# EAGLE schematic untitled (EAGLE 9.6.2)
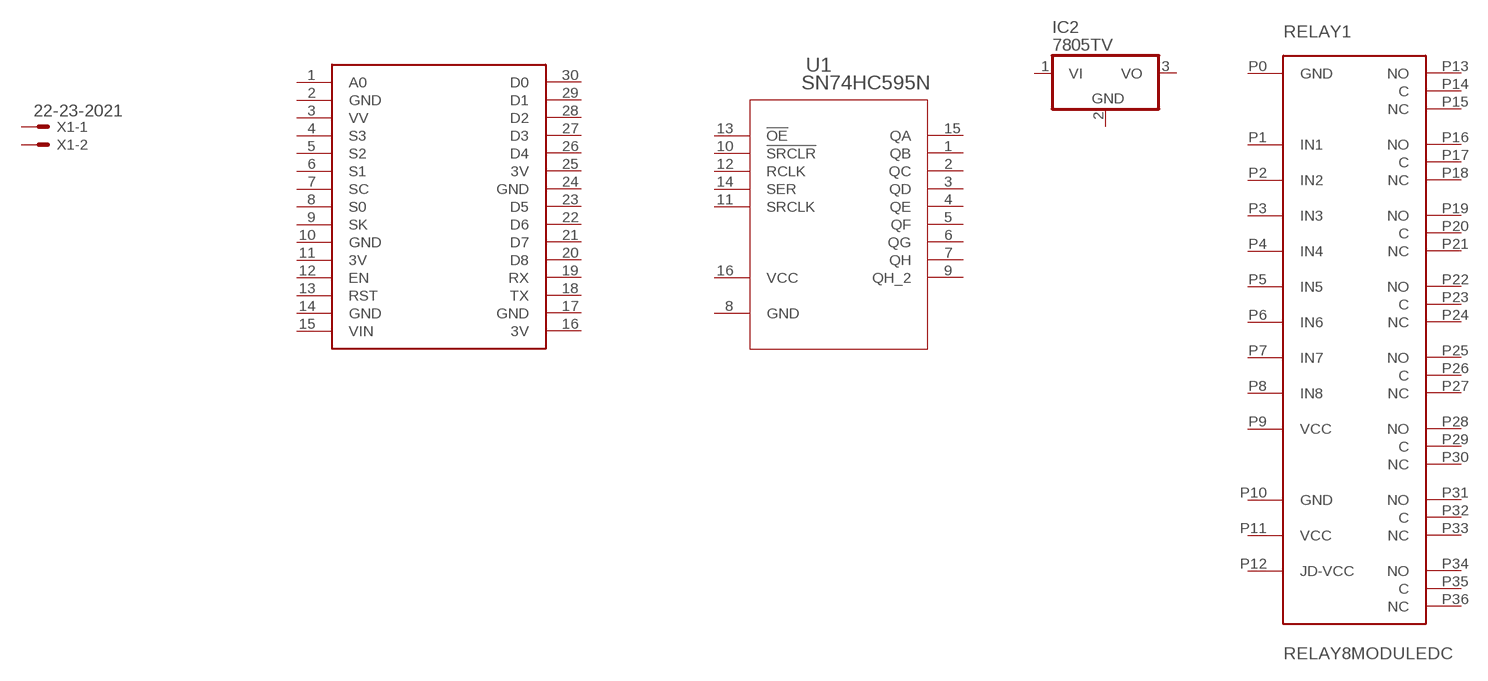
[diagram p0: schematic, sheet 1]

## Parts
IC2  7805TV  [TO220V]
RELAY1  RELAY8MODULEDC  [RELAY8MODULEDC]
U1  SN74HC595N  [N16]
U$1  NODEMCU  [NODEMCU]
X1  22-23-2021  [22-23-2021]
Unconnected: IC2.1(VI) IC2.2(GND) IC2.3(VO) RELAY1.P0(GND) RELAY1.P1(IN1) RELAY1.P2(IN2) RELAY1.P3(IN3) RELAY1.P4(IN4) RELAY1.P5(IN5) RELAY1.P6(IN6) RELAY1.P7(IN7) RELAY1.P8(IN8) RELAY1.P9(VCC) RELAY1.P10(GND) RELAY1.P11(VCC) RELAY1.P12(JD-VCC) RELAY1.P13(NO) RELAY1.P14(C) RELAY1.P15(NC) RELAY1.P16(NO) RELAY1.P17(C) RELAY1.P18(NC) RELAY1.P19(NO) RELAY1.P20(C) RELAY1.P21(NC) RELAY1.P22(NO) RELAY1.P23(C) RELAY1.P24(NC) RELAY1.P25(NO) RELAY1.P26(C) RELAY1.P27(NC) RELAY1.P28(NO) RELAY1.P29(C) RELAY1.P30(NC) RELAY1.P31(NO) RELAY1.P32(C) RELAY1.P33(NC) RELAY1.P34(NO) RELAY1.P35(C) RELAY1.P36(NC) U1.1(QB) U1.2(QC) U1.3(QD) U1.4(QE) U1.5(QF) U1.6(QG) U1.7(QH) U1.9(QH_2) U1.10(!SRCLR) U1.11(SRCLK) U1.12(RCLK) U1.13(!OE) U1.14(SER) U1.15(QA) U$1.1(A0) U$1.3(VV) U$1.4(S3) U$1.5(S2) U$1.6(S1) U$1.7(SC) U$1.8(S0) U$1.9(SK) U$1.12(EN) U$1.13(RST) U$1.15(VIN) U$1.18(TX) U$1.19(RX) U$1.20(D8) U$1.21(D7) U$1.22(D6) U$1.23(D5) U$1.26(D4) U$1.27(D3) U$1.28(D2) U$1.29(D1) U$1.30(D0) X1.1 X1.2

## Power pins joined to a net without a drawn wire
3V: U$1.11(3V) U$1.16(3V) U$1.25(3V)
GND: U1.8(GND) U$1.2(GND) U$1.10(GND) U$1.14(GND) U$1.17(GND) U$1.24(GND)
VCC: U1.16(VCC)

## Library data of the parts
IC2 = linear:78*: Positive VOLTAGE REGULATOR Source: http://cache.national.com/ds/LM/LM78L05.pdf http://www.fairchildsemi.com/ds/LM/LM7805.pdf
RELAY1 = Relay-8moduleDC:RELAY8MODULEDC
U1 = TI-SN74HC595:SN74HC595N; DATASHEET_URL: http://www.ti.com/lit/gpn/SN74HC595; DESCRIPTION: 8-Bit Shift Registers With 3-State Output Registers; FAMILY_NAME: SHIFT REGISTER; GENERIC_PART_NUMBER: SN74HC595; INDUSTRY_STD_PKG_TYPE: PDIP; MANUFACTURER: Texas Instruments; PACKAGE_DESIGNATOR: N; PIN_COUNT: 16
U$1 = nodemcu:NODEMCU
X1 = con-molex:22-23-2021: .100" (2.54mm) Center Header - 2 Pin; MF: MOLEX; MPN: 22-23-2021; OC_FARNELL: 1462926; OC_NEWARK: 25C3832